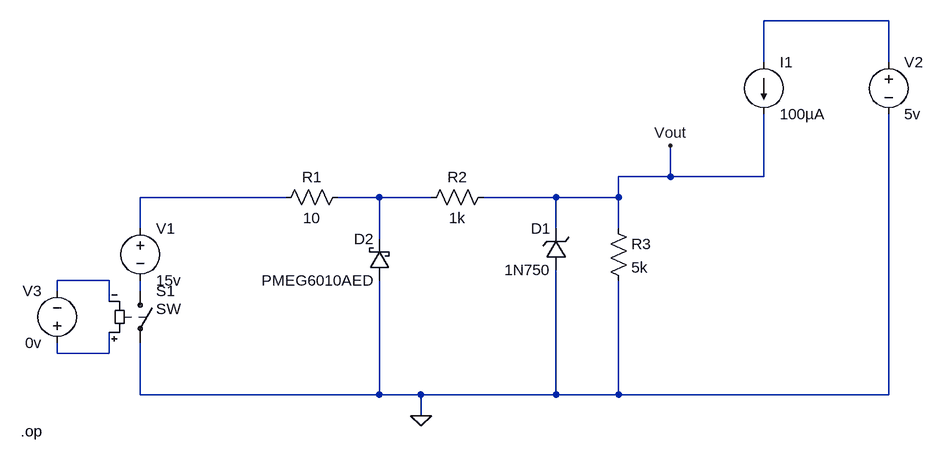
[diagram p0: schematic TabStopReaderModeling.asc]
TabStopReaderModeling.asc, the LTspice schematic file:
Version 4
SHEET 1 1196 680
WIRE 1136 -208 944 -208
WIRE 944 -144 944 -208
WIRE 1136 -144 1136 -208
WIRE 800 32 800 -16
WIRE 800 32 720 32
WIRE 944 32 944 -64
WIRE 944 32 800 32
WIRE 208 64 -16 64
WIRE 352 64 288 64
WIRE 432 64 352 64
WIRE 624 64 512 64
WIRE 720 64 720 32
WIRE 720 64 624 64
WIRE -16 112 -16 64
WIRE 624 112 624 64
WIRE 720 112 720 64
WIRE 352 128 352 64
WIRE -64 192 -144 192
WIRE -144 208 -144 192
WIRE -16 208 -16 192
WIRE -64 224 -64 192
WIRE -144 304 -144 288
WIRE -64 304 -64 272
WIRE -64 304 -144 304
WIRE -16 368 -16 288
WIRE 352 368 352 192
WIRE 352 368 -16 368
WIRE 416 368 352 368
WIRE 624 368 624 176
WIRE 624 368 416 368
WIRE 720 368 720 192
WIRE 720 368 624 368
WIRE 1136 368 1136 -64
WIRE 1136 368 720 368
WIRE 416 400 416 368
FLAG 416 400 0
FLAG 800 -16 Vout
DATAFLAG -80 192 ""
DATAFLAG -80 192 ""
DATAFLAG -96 304 ""
DATAFLAG 0 368 ""
DATAFLAG 128 64 ""
DATAFLAG 320 64 ""
DATAFLAG 544 64 ""
DATAFLAG 1088 -208 ""
DATAFLAG 720 112 "I(R3)"
DATAFLAG 832 32 ""
SYMBOL voltage -16 96 R0
WINDOW 123 0 0 Left 0
WINDOW 39 24 124 Left 2
SYMATTR InstName V1
SYMATTR Value 15v
SYMBOL sw -16 192 R0
WINDOW 3 24 44 Left 2
SYMATTR InstName S1
SYMBOL res 304 48 R90
WINDOW 0 0 56 VBottom 2
WINDOW 3 32 56 VTop 2
SYMATTR InstName R1
SYMATTR Value 10
SYMBOL res 528 48 R90
WINDOW 0 0 56 VBottom 2
WINDOW 3 32 56 VTop 2
SYMATTR InstName R2
SYMATTR Value 1k
SYMBOL res 704 96 R0
SYMATTR InstName R3
SYMATTR Value 5k
SYMBOL zener 640 176 R180
WINDOW 0 24 64 Left 2
WINDOW 3 24 0 Left 2
SYMATTR InstName D1
SYMATTR Value 1N750
SYMATTR Description Diode
SYMATTR Type diode
SYMBOL schottky 368 192 R180
WINDOW 0 24 64 Left 2
WINDOW 3 24 0 Left 2
SYMATTR InstName D2
SYMATTR Value PMEG6010AED
SYMATTR Description Diode
SYMATTR Type diode
SYMBOL current 944 -144 R0
WINDOW 123 0 0 Left 0
WINDOW 39 0 0 Left 0
SYMATTR InstName I1
SYMATTR Value 100µA
SYMBOL voltage 1136 -160 R0
WINDOW 123 0 0 Left 0
WINDOW 39 0 0 Left 0
SYMATTR InstName V2
SYMATTR Value 5v
SYMBOL voltage -144 304 R180
WINDOW 0 24 96 Left 2
WINDOW 3 24 16 Left 2
WINDOW 123 0 0 Left 0
WINDOW 39 0 0 Left 0
SYMATTR InstName V3
SYMATTR Value 0v
TEXT -200 424 Left 2 !.op

The netlist it stands for:
* TabStopReaderModeling.asc
V1 N002 N005 15v
S1 N005 0 N006 N004 SW
R1 N003 N002 10
R2 Vout N003 1k
R3 Vout 0 5k
D1 0 Vout 1N750
D2 0 N003 PMEG6010AED
I1 N001 Vout 100µA
V2 N001 0 5v
V3 N006 N004 0v
.model D D
.lib standard.dio
.op
.backanno
.end